# EasyEDA schematic SCH_solar powered business card.json
TITLE: Sheet_1; REV: 1.0; Date: 2025-06-18; Sheet: 1/1; Drawn By: smirzaunsu; Company: Your Company
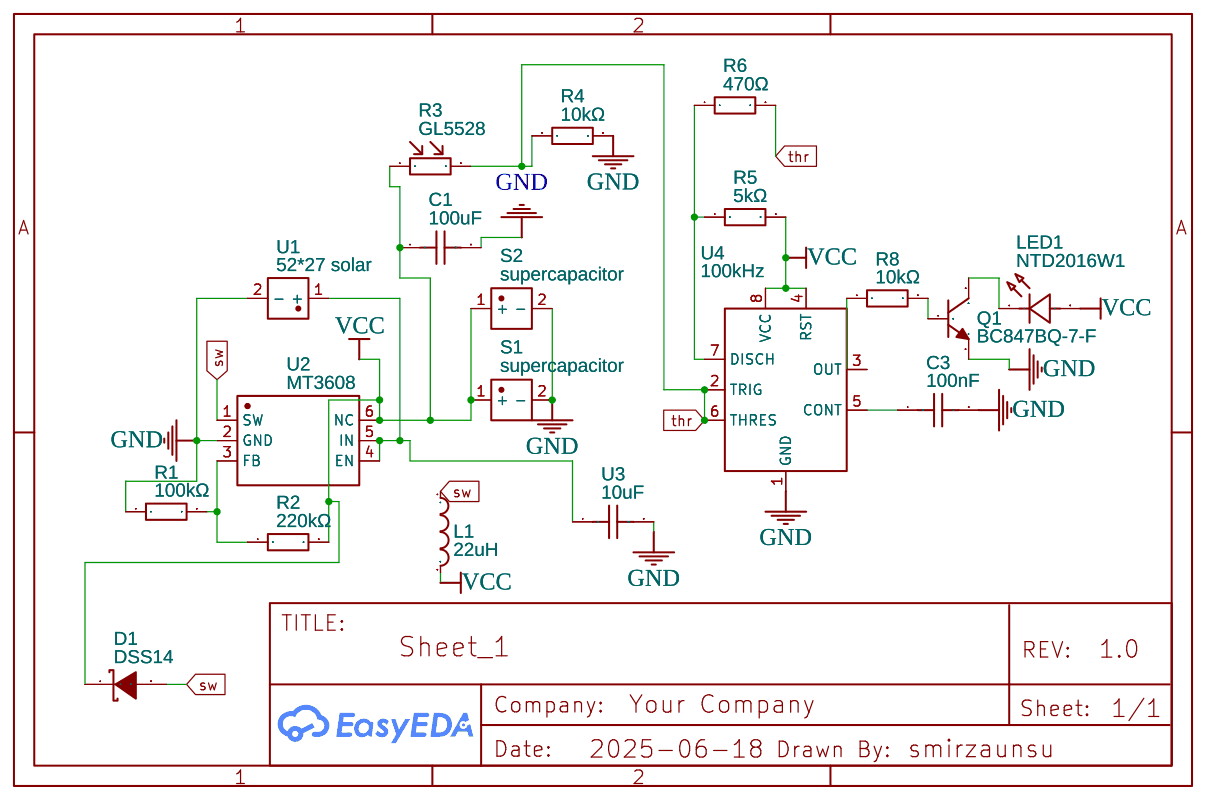
[diagram p0: schematic sheet]

## Parts
C1  100uF  [C0805]
C3  100nF  [C0603]
D1  DSS14  [SOD-123_L2.8-W1.8-LS3.7-RD]
L1  22uH  [IND-SMD_L10.5-W10.5]
LED1  NTD2016W1  [LED-SMD_NTD2016W1]
Q1  BC847BQ-7-F  [SOT-23-3_L2.9-W1.3-P1.90-LS2.4-BR]
R1  100kΩ  [R0603]
R2  220kΩ  [R0603]
R3  GL5528  [RES-TH_L5.1-W4.3-P3.40-D0.5]
R4  10kΩ  [R0603]
R5  5kΩ  [R0603]
R6  470Ω  [R0603]
R8  10kΩ  [R0603]
S1  supercapacitor  [SUPERCAPACITORFP]
S2  supercapacitor  [SUPERCAPACITORFP]
U1  52*27 solar  [52*27SOLARFP]
U2  MT3608  [SOT-23-6_L2.9-W1.6-P0.95-LS2.8-BL]
U3  10uF  [C0603]
U4  100kHz  [SOIC-8_L4.9-W3.9-P1.27-LS6.0-BL]

## Library data of the parts
C1 = CGA0805X5R107M6R3MT: Supplier: LCSC; Supplier Part: C23692977; Manufacturer: HRE(芯声); JLCPCB Part Class: Extended Part; Contributor: lcsc
C3 = CGA0603X7R104K100JT: Supplier: LCSC; Supplier Part: C36911391; Manufacturer: HRE(芯声); JLCPCB Part Class: Extended Part; Contributor: lcsc
D1 = DSS14: Supplier: LCSC; Manufacturer: 星海; Supplier Part: C59293; JLCPCB Part Class: Extended Part
L1 = SLD10D40S-220MTT: Contributor: LCSC; Supplier: LCSC; Supplier Part: C182172; Manufacturer: Sunltech(韩国顺磁); JLCPCB Part Class: Extended Part
LED1 = NTD2016W1: Contributor: LCSC; Supplier: LCSC; Supplier Part: C2917195; Manufacturer: 国星光电; JLCPCB Part Class: Extended Part
Q1 = BC847BQ-7-F: Contributor: lcsc; Supplier: LCSC; Supplier Part: C2922347; Manufacturer: DIODES(美台); JLCPCB Part Class: Extended Part
R1 = RT0603DRE07100KL: Contributor: LCSC; Supplier: LCSC; Supplier Part: C327122; Manufacturer: YAGEO(国巨); JLCPCB Part Class: Extended Part
R2 = RC0603JR-07220KL: Supplier: LCSC; Manufacturer: YAGEO(国巨); Supplier Part: C137647; JLCPCB Part Class: Extended Part
R3 = GL5528: Supplier: LCSC; Manufacturer: 森霸; Supplier Part: C125627; JLCPCB Part Class: Extended Part
R4 = 0603WAD1002T5E: Contributor: LCSC; Supplier: LCSC; Supplier Part: C167144; Manufacturer: UNI-ROYAL(厚声); JLCPCB Part Class: Extended Part
R5 = RT0603BRE075KL: Contributor: lcsc; Supplier: LCSC; Supplier Part: C862232; Manufacturer: YAGEO(国巨); JLCPCB Part Class: Extended Part
R6 = WR06X4700FTL: Contributor: LCSC; Supplier: LCSC; Manufacturer: Walsin(华新科); Supplier Part: C163920; JLCPCB Part Class: Extended Part
R8 = AC0603FR-0710KL: Supplier: LCSC; Manufacturer: YAGEO(国巨); Supplier Part: C116677; JLCPCB Part Class: Extended Part
S1 S2 = supercapacitor: Contributor: smirzaunsu
U1 = 52*27 solar: Contributor: smirzaunsu
U2 = MT3608: Supplier: LCSC; Manufacturer: 西安航天民芯; Supplier Part: C84817; JLCPCB Part Class: Extended Part
U3 = CGA0603X5R106K100JT: Supplier: LCSC; Supplier Part: C6119842; Manufacturer: HRE(芯声); Contributor: lcsc; JLCPCB Part Class: Extended Part
U4 = NE555DR: Supplier: LCSC; Manufacturer: TI(德州仪器); Supplier Part: C7593; JLCPCB Part Class: Extended Part

## Nets
GND: C1.2 C3.2 Q1.2(E) R1.1 R4.2 S1.2(-) S2.2(-) U1.2(-) U2.2(GND) U3.2 U4.1(GND)
VCC: C1.1 D1.1(K) L1.2 LED1.2(+) R2.2 R3.1 R5.2 S1.1(+) S2.1(+) U2.6(NC) U4.4(RST) U4.8(VCC)
sw: D1.2(A) L1.1 U2.1(SW)
thr: R3.2 R4.1 R6.2 U4.2(TRIG) U4.6(THRES)
Net-(C3-1): C3.1 U4.5(CONT)
Net-(LED1-1): LED1.1(-) Q1.3(C)
Net-(Q1-1): Q1.1(B) R8.2
Net-(R1-2): R1.2 R2.1 U2.3(FB)
Net-(R5-1): R5.1 R6.1 U4.7(DISCH)
Net-(R8-1): R8.1 U4.3(OUT)
Net-(U1-1): U1.1(+) U2.4(EN) U2.5(IN) U3.1
